# EAGLE design comp_pucoe-v1.0c (EAGLE 4.16)
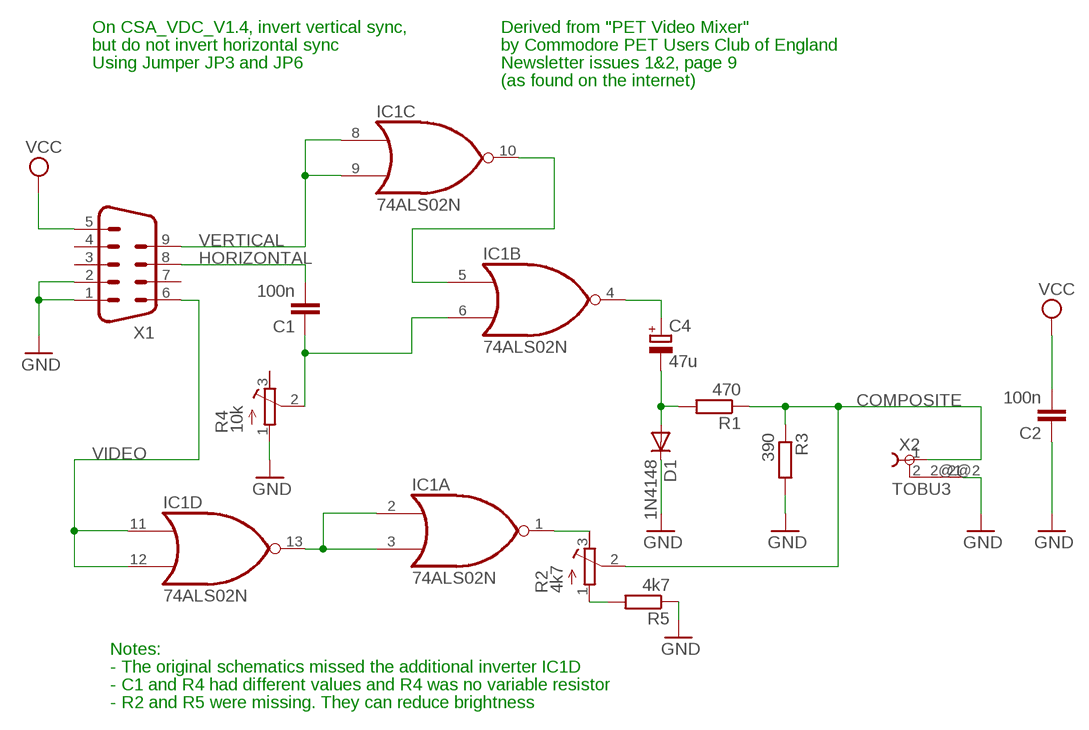
[diagram p0: schematic, sheet 1]

## Parts
C1  100n  C-EU050-025X075  [C050-025X075]
C2  100n  C-EU050-025X075  [C050-025X075]
C4  47u  CPOL-EUE5-6  [E5-6]
D1  1N4148  [DO35-10]
IC1  74ALS02N  [DIL14]
R1  470  R-EU_0207/10  [0207/10]
R2  4k7  R-TRIMM3339P  [RTRIM3339P]
R3  390  R-EU_0207/10  [0207/10]
R4  10k  R-TRIMM3339P  [RTRIM3339P]
R5  4k7  R-EU_0207/10  [0207/10]
X1  M09H  [M09H]
X2  TOBU3  [TOBU3]

## Nets
COMPOSITE: R1.1 R2.2(S) R3.1 X2.1
GND: C2.1 D1.C R3.2 R4.1(E) R5.1 X1.1 X1.2 X2.2@2
HORIZONTAL: C1.2 X1.8
N$1: C1.1 IC1.6(B:I1) R4.2(S)
N$2: IC1.5(B:I0) IC1.10(C:O)
N$3: C4.+ IC1.4(B:O)
N$4: C4.- D1.A R1.2
N$5: IC1.2(A:I0) IC1.3(A:I1) IC1.13(D:O)
N$6: IC1.1(A:O) R2.3(A)
N$7: R2.1(E) R5.2
VCC: C2.2 X1.5
VERTICAL: IC1.8(C:I0) IC1.9(C:I1) X1.9
VIDEO: IC1.11(D:I0) IC1.12(D:I1) X1.6
Unconnected: R4.3(A) X1.3 X1.4 X1.7 X2.2 X2.2@1

## Notes on the sheet
- On CSA_VDC_V1.4, invert vertical sync, | Derived from "PET Video Mixer"
- but do not invert horizontal sync | by Commodore PET Users Club of England
- Using Jumper JP3 and JP6 | Newsletter issues 1&2, page 9
- (as found on the internet)
- Notes:
- - The original schematics missed the additional inverter IC1D
- - C1 and R4 had different values and R4 was no variable resistor
- - R2 and R5 were missing. They can reduce brightness

## Power pins joined to a net without a drawn wire
GND: IC1.7(P:GND)
VCC: IC1.14(P:VCC)

## Library data of the parts
C1 C2 = rcl:C-EU: CAPACITOR, European symbol
C4 = rcl:CPOL-EU: POLARIZED CAPACITOR, European symbol
D1 = diode:1N4148: DIODE high speed (Philips)
IC1 = 74xx-us:74*02: Quad 2-input NOR gate
R1 R3 R5 = rcl:R-EU_: RESISTOR, European symbol
R2 R4 = rcl:R-TRIMM: Trimm resistor
X1 = con-subd:M09: SUB-D
X2 = con-hirschmann:TOBU3: Female Cinch CONNECTOR

## Board
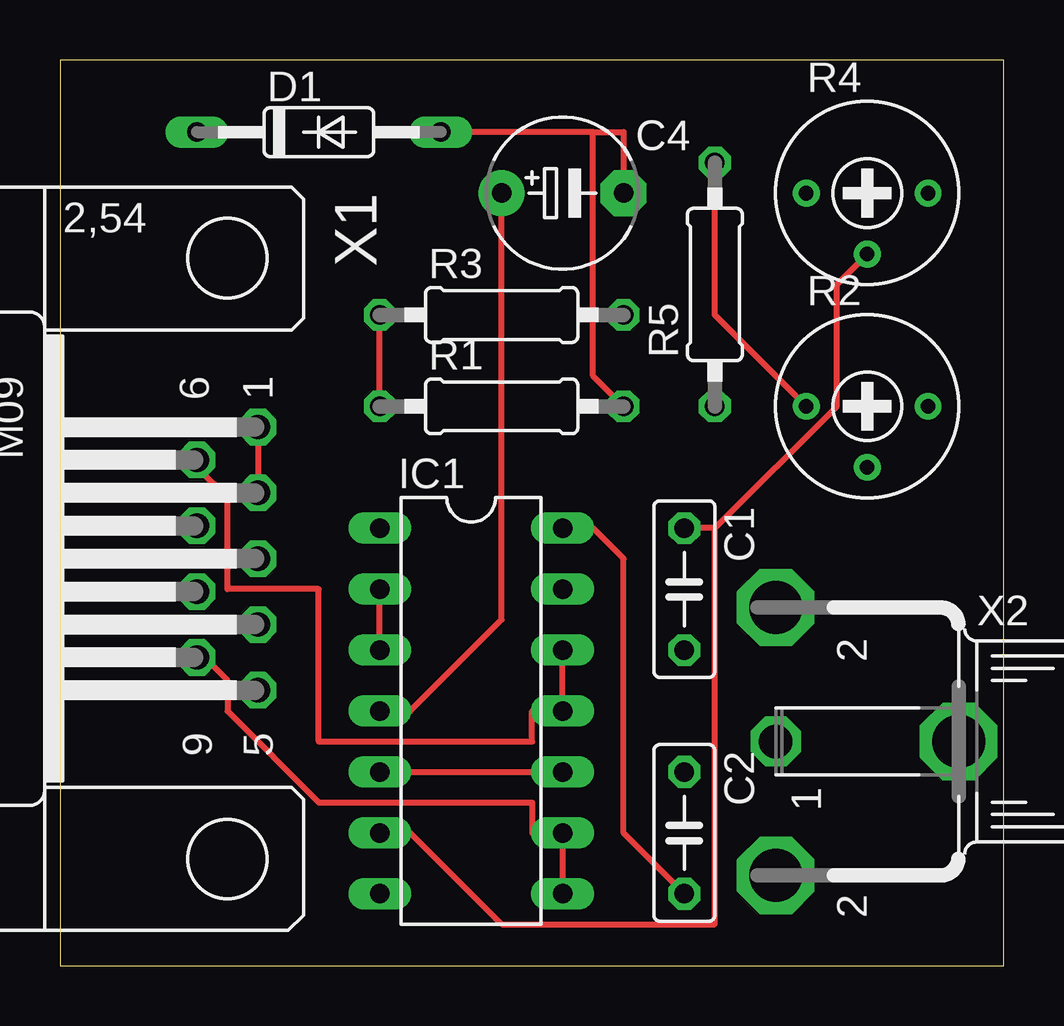
[diagram p1: board, top side]
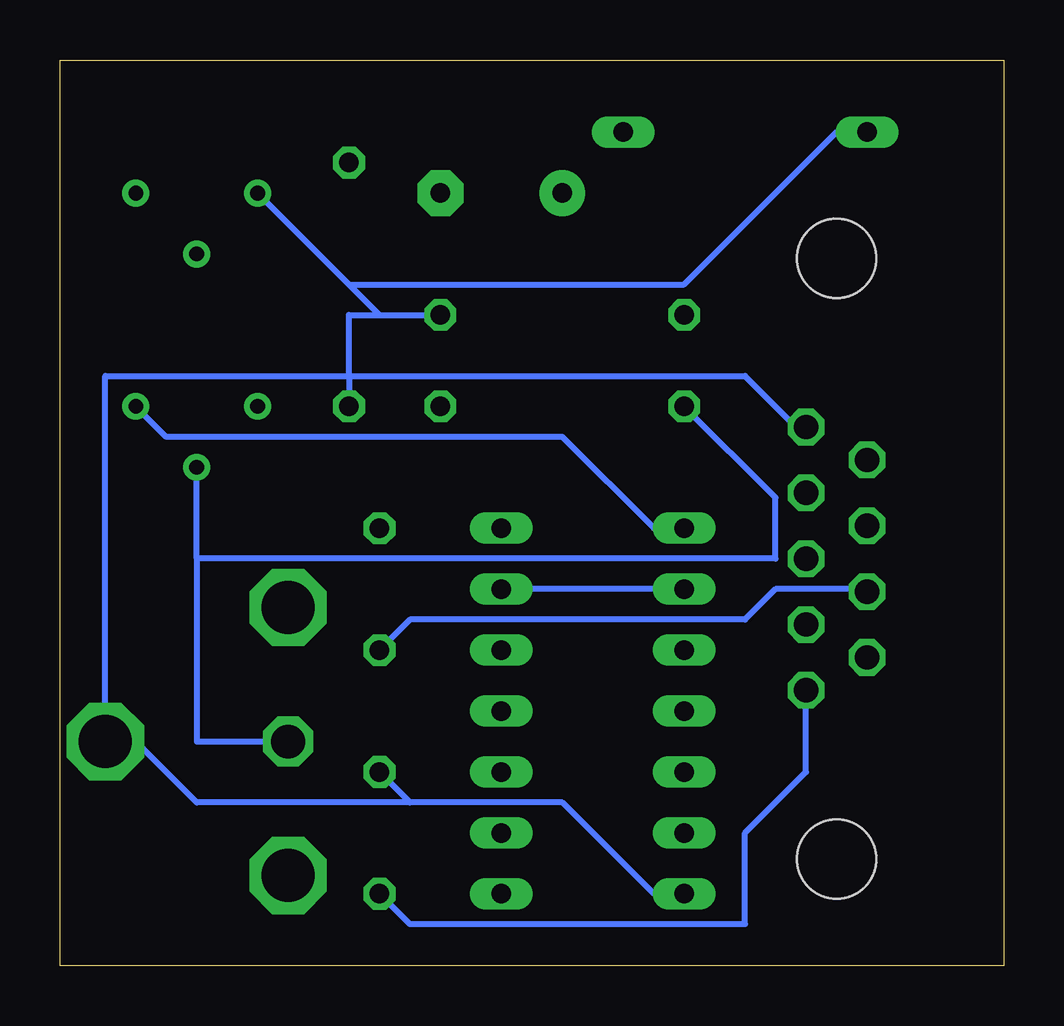
[diagram p2: board, bottom side, seen from below]

Size 39.35 x 37.77 mm. Coordinates in mm from the lower left corner, seen from the top.
Outline: 0,0 39.35,0 39.35,37.77 0,37.77 0,0
Copper layers (1*16): Top 0.035mm / dielectric 1.5mm / Bottom 0.035mm
Design rules "default": minimum track width 10mil, minimum drill 24mil, track to track 8mil, track to pad 8mil, pad to pad 8mil, via to via 8mil, smd to smd 8mil, copper to edge 40mil, drill to drill 8mil, minimum pad ring 10mil, minimum via ring 8mil, stop-mask expansion 4mil, vias tented up to drill 0mil, thermal gap 10mil

### Footprints (pad centres in the part's own frame; a part is rotated, then mirrored left to right if it is on the bottom)
C050-025X075 = drill 0.813 octagon: 1 -2.54,0; 2 2.54,0
E5-6 = drill 0.813 pad 1.905 round: + -2.54,0 | drill 0.813 pad 1.905 octagon: - 2.54,0
DO35-10 = drill 0.813 long: A 5.08,0; C -5.08,0
DIL14 = drill 0.813 long: 1 -7.62,-3.81; 2 -5.08,-3.81; 3 -2.54,-3.81; 4 0,-3.81; 5 2.54,-3.81; 6 5.08,-3.81; 7 7.62,-3.81; 8 7.62,3.81; 9 5.08,3.81; 10 2.54,3.81; 11 0,3.81; 12 -2.54,3.81; 13 -5.08,3.81; 14 -7.62,3.81
0207/10 = drill 0.813 octagon: 1 -5.08,0; 2 5.08,0
RTRIM3339P = drill 0.61 round: 1 -2.54,0; 2 0,-2.54; 3 2.54,0
M09H = drill 1.016 octagon: 1 -5.486,1.27; 2 -2.743,1.27; 3 0,1.27; 4 2.743,1.27; 5 5.486,1.27; 6 -4.115,-1.27; 7 -1.372,-1.27; 8 1.372,-1.27; 9 4.115,-1.27 | hole 3.302: 12.522,0; -12.522,0
TOBU3 = drill 1.397 octagon: 1 0,-2.54 | drill 2.21 octagon: 2 5.588,-2.54; 2@1 -5.588,-2.54; 2@2 0,5.08

### Placement (x,y rotation side)
C1  26.03,15.71 270 top
C2  26.03,5.55 270 top
C4  20.95,32.22 0 top
D1  10.79,34.76 0 top
IC1  17.14,10.63 270 top
R1  18.41,23.33 0 top
R2  33.65,23.33 0 top
R3  18.41,27.14 0 top
R4  33.65,32.22 0 top
R5  27.3,28.41 90 top
X1  6.98,16.98 270 top
X2  32.38,9.36 270 top

### Tracks (layer width: path | path; a pad name or v marks a point on that pad's centre or on a via)
COMPOSITE
  Top 0.254: R1.1 R3.1
  Bottom 0.254: 33.65,16.98 33.65,9.36 X2.1 | 33.65,16.98 R2.2 | R1.1 9.52,19.52 9.52,16.98 33.65,16.98
GND
  Top 0.254: 8.25,19.52 X1.2 X1.1
  Bottom 0.254: 24.76,6.82 18.41,6.82 14.6,3.01 IC1.7 | 24.76,6.82 C2.1 | 24.76,6.82 33.65,6.82 36.19,9.36 X2.2@2 37.46,24.6 27.3,24.6 | 26.03,27.14 27.3,28.41 | 27.3,28.41 R4.1 | 26.03,27.14 R3.2 | 27.3,24.6 27.3,27.14 26.03,27.14 | 27.3,24.6 R5.1 | 27.3,28.41 13.33,28.41 6.98,34.76 D1.C | 27.3,24.6 10.79,24.6 8.25,22.06 X1.1
HORIZONTAL
  Bottom 0.254: C1.2 24.76,14.44 10.79,14.44 9.52,15.71 5.71,15.71 X1.8
N$1
  Top 0.254: R4.2 32.38,28.41 32.38,23.33 27.3,18.25 | 27.3,18.25 C1.1 | 27.3,18.25 27.3,1.74 18.41,1.74 14.6,5.55 IC1.6
N$2
  Top 0.254: IC1.5 IC1.10
N$3
  Top 0.254: C4.+ 18.41,14.44 14.6,10.63 IC1.4
N$4
  Top 0.254: 22.22,34.76 23.49,34.76 C4.- | 22.22,34.76 D1.A | R1.2 22.22,24.6 22.22,34.76
N$5
  Top 0.254: IC1.3 IC1.2
  Bottom 0.254: IC1.2 IC1.13
N$6
  Bottom 0.254: R2.3 34.92,22.06 18.41,22.06 14.6,18.25 IC1.1
N$7
  Top 0.254: R2.1 27.3,27.14 R5.2
VCC
  Top 0.254: C2.2 23.49,5.55 23.49,16.98 22.22,18.25 IC1.14
  Bottom 0.254: C2.2 24.76,1.74 10.79,1.74 10.79,5.55 8.25,8.09 X1.5 8.25,11.9
VERTICAL
  Top 0.254: IC1.8 IC1.9 19.68,5.55 19.68,6.82 10.79,6.82 6.98,10.63 6.98,11.9 5.71,13.17 X1.9
VIDEO
  Top 0.254: IC1.12 IC1.11 19.68,10.63 19.68,9.36 10.79,9.36 10.79,15.71 6.98,15.71 6.98,19.52 5.71,20.79 X1.6